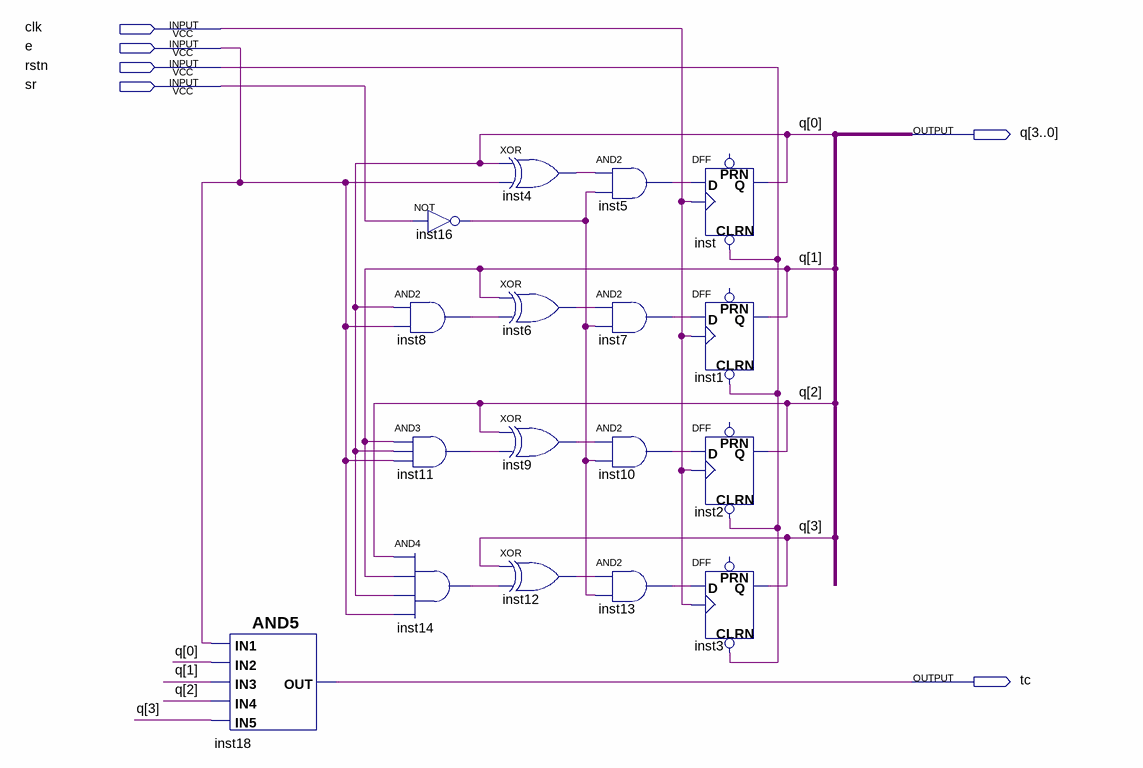
[diagram p0: schematic sheet]
// Quartus schematic ctr4div16e_sr.bdf as structural Verilog: 17 symbols, 6 pins
module ctr4div16e_sr (
  input  clk,
  input  e,
  input  rstn,
  input  sr,
  output [3:0] q,
  output tc
);

  wire inst4_out, inst5_out, inst6_out, inst7_out, inst8_out, inst9_out, inst10_out, inst11_out, inst12_out,
       inst13_out, inst14_out, inst16_out;

  and inst18 (tc, e, q[0], q[1], q[2], q[3]);
  not inst16 (inst16_out, sr);
  and inst8 (inst8_out, q[0], e);
  and inst11 (inst11_out, q[1], q[0], e);
  and inst14 (inst14_out, q[2], q[1], q[0], e);
  xor inst4 (inst4_out, q[0], e);
  xor inst6 (inst6_out, q[1], inst8_out);
  xor inst9 (inst9_out, q[2], inst11_out);
  xor inst12 (inst12_out, q[3], inst14_out);
  and inst5 (inst5_out, inst4_out, inst16_out);
  and inst7 (inst7_out, inst6_out, inst16_out);
  and inst10 (inst10_out, inst9_out, inst16_out);
  and inst13 (inst13_out, inst12_out, inst16_out);
  DFF inst (.CLRN(rstn), .CLK(clk), .D(inst5_out), .Q(q[0]));  // open: PRN
  DFF inst1 (.CLRN(rstn), .CLK(clk), .D(inst7_out), .Q(q[1]));  // open: PRN
  DFF inst2 (.CLRN(rstn), .CLK(clk), .D(inst10_out), .Q(q[2]));  // open: PRN
  DFF inst3 (.CLRN(rstn), .CLK(clk), .D(inst13_out), .Q(q[3]));  // open: PRN
endmodule
